# EAGLE design NAVMAN-GPSBOARD (EAGLE 6.5.0)
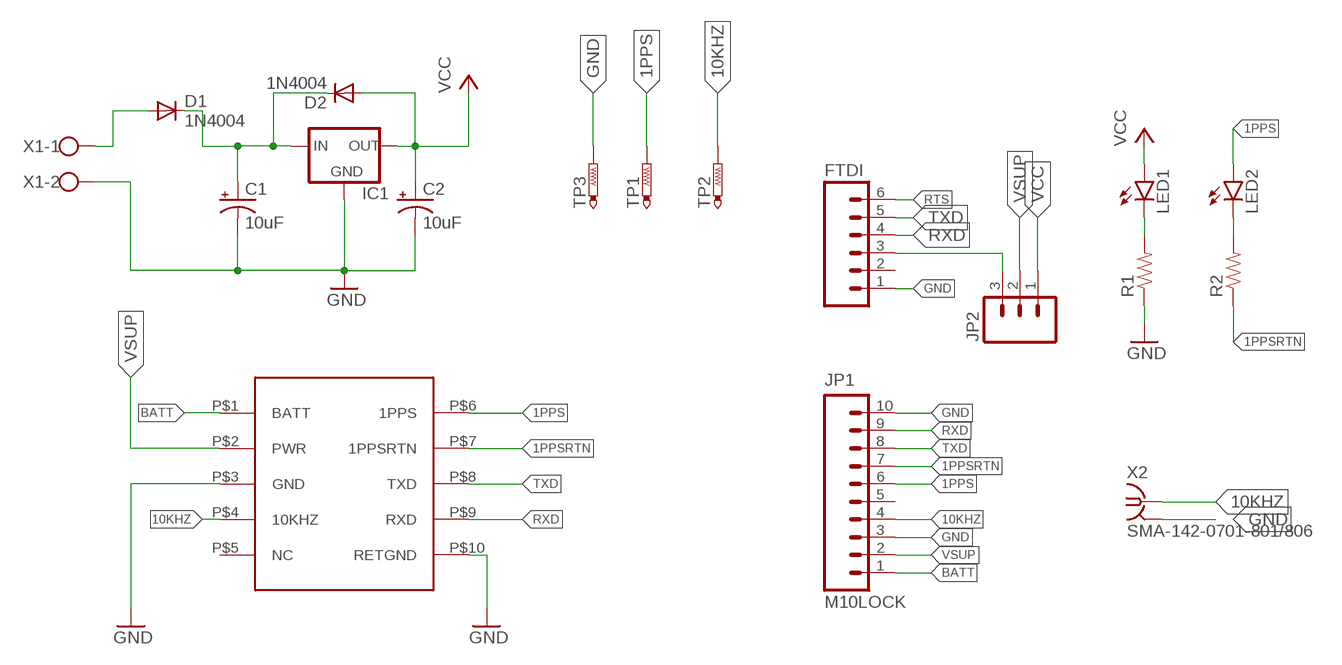
[diagram p0: schematic, sheet 1]

## Parts
C1  10uF  10UF-25V-20%(PTH)  [CPOL-RADIAL-10UF-25V]
C2  10uF  10UF-25V-20%(PTH)  [CPOL-RADIAL-10UF-25V]
D1  1N4004  [DO41-10]
D2  1N4004  [DO41-10]
FTDI  M06LOCK  [1X06_LOCK]
IC1  V_REG_78XXSINK  [TO220-IGO]
JP1  M10LOCK  [1X10_LOCK]
JP2  M03LOCK  [1X03_LOCK]
LED1  LED5MM  [LED5MM]
LED2  LED5MM  [LED5MM]
R1  RESISTORPTH-1/4W  [AXIAL-0.4]
R2  RESISTORPTH-1/4W  [AXIAL-0.4]
TP1  PTR1PAD1-20Y  [P1-20Y]
TP2  PTR1PAD1-20Y  [P1-20Y]
TP3  PTR1PAD1-20Y  [P1-20Y]
TU60-D001  NAVMANJUPITERTU60  [TU60-D001]
X1  W237-102  [W237-102]
X2  SMA-142-0701-801/806  [J502-ND-142-0701-801/806]

## Nets
1PPS: JP1.6 LED2.A TP1.TP TU60-D001.P$6(1PPS)
1PPSRTN: JP1.7 R2.P$1 TU60-D001.P$7(1PPSRTN)
10KHZ: JP1.4 TP2.TP TU60-D001.P$4(10KHZ) X2.1
BATT: JP1.1 TU60-D001.P$1(BATT)
GND: C1.2(-) C2.2(-) FTDI.1 IC1.GND JP1.3 JP1.10 R1.P$1 TP3.TP TU60-D001.P$3(GND) TU60-D001.P$10(RETGND) X1.2 X2.G@1 X2.G@2 X2.G@3 X2.G@4
N$1: C1.1(+) D1.C D2.C IC1.IN
N$2: LED1.K(C) R1.P$2
N$3: LED2.K(C) R2.P$2
N$4: FTDI.3 JP2.3
N$6: D1.A X1.1
RTS: FTDI.6
RXD: FTDI.4 JP1.9 TU60-D001.P$9(RXD)
TXD: FTDI.5 JP1.8 TU60-D001.P$8(TXD)
VCC: C2.1(+) D2.A IC1.OUT JP2.1 LED1.A
VSUP: JP1.2 JP2.2 TU60-D001.P$2(PWR)
Unconnected: FTDI.2 JP1.5 TU60-D001.P$5(NC)

## Library data of the parts
C1 C2 = SparkFun-Capacitors:10UF-25V-20%(PTH): CAP-08440; PROD_ID: CAP-08440
D1 D2 = diode:1N4004: DIODE general purpose rectifier, 1 A
FTDI = SparkFun-Connectors:M06: Header 6 Standard 6-pin 0.1" header. Use with straight break away headers (SKU : PRT-00116), right angle break away headers (PRT-00553), swiss pins (PRT-00743), machine pins (PRT-00117), and female headers (PRT-00115). Molex polarized connector foot print use with SKU : PRT-08094 with associated crimp pins and housings. NOTES ON THE VARIANTS LOCK and LOCK_LONGPADS... This footprint was designed to help hold the alignment of a through-hole component (i.e. 6-pin header) while soldering it into place. You may notice that each hole has been shifted either up or down by 0.005 of an inch from it's more standard position (which is a perfectly straight line). This slight alteration caused the pins (the squares in the middle) to touch the edges of the holes. Because they are alternating, it causes a "brace" to hold the component in place. 0.005 has proven to be the perfect amount of "off-center" position when using our standard breakaway headers. Although looks a little odd when you look at the bare footprint, once you have a header in there, the alteration is very hard to notice. Also,if you push a header all the way into place, it is covered up entirely on the bottom side. This idea of altering the position of holes to aid alignment will be further integrated into the Sparkfun Library for other footprints. It can help hold any component with 3 or more connection pins.
IC1 = SparkFun-PowerIC:V_REG_78XX: Voltage Regulator Standard 7805 5V regulator. IGO (Input Ground Output). Spark Fun Electronics SKU : COM-00107
JP1 = SparkFun-Connectors:M10: Header 10 Standard 10-pin 0.1" header. Use with straight break away headers (SKU : PRT-00116), right angle break away headers (PRT-00553), swiss pins (PRT-00743), machine pins (PRT-00117), and female headers (PRT-00115).
JP2 = SparkFun-Connectors:M03: Header 3 Standard 3-pin 0.1" header. Use with straight break away headers (SKU : PRT-00116), right angle break away headers (PRT-00553), swiss pins (PRT-00743), machine pins (PRT-00117), and female headers (PRT-00115). Molex polarized connector foot print use with SKU : PRT-08232 with associated crimp pins and housings.
LED1 LED2 = SparkFun-LED:LED: LEDs Standard schematic elements and footprints for 5mm, 3mm, 1206, and 0603 sized LEDs. 5mm - Spark Fun Electronics SKU : COM-00529 (and others)
R1 R2 = SparkFun-Resistors:RESISTOR: Resistor Basic schematic elements and footprints for 0603, 1206, and PTH resistors.
TP1-TP3 = testpad:PTR1: TEST PIN
TU60-D001 = navman:NAVMANJUPITERTU60
X1 = con-wago-500:W237-102: WAGO SCREW CLAMP; MPN: 237-102; OC_FARNELL: unknown; OC_NEWARK: 70K9898
X2 = con-coax:SMA-: SMA 50 Ohm End Launch Jack Receptacle - Round Contact Johnson Components Source: www.johnsoncomponents.com .. J502-ND.pdf; MF: JOHNSON COMPONENTS; MPN: 142-0701-801; OC_FARNELL: 1608592; OC_NEWARK: 90F2624

## Board
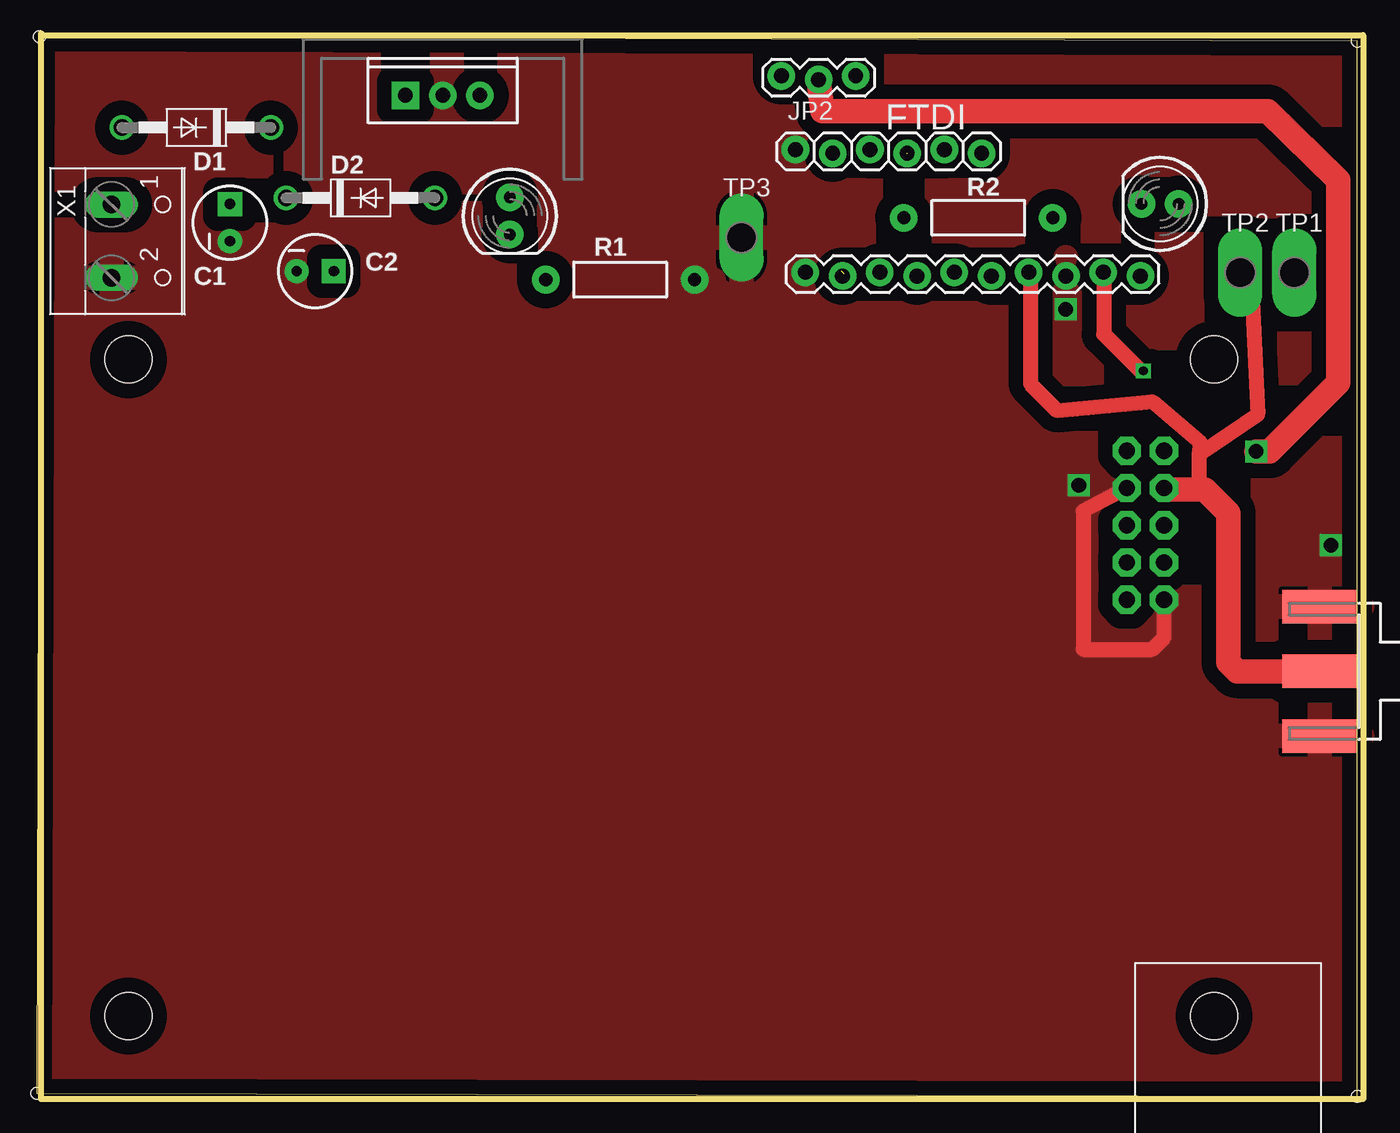
[diagram p1: board, top side]
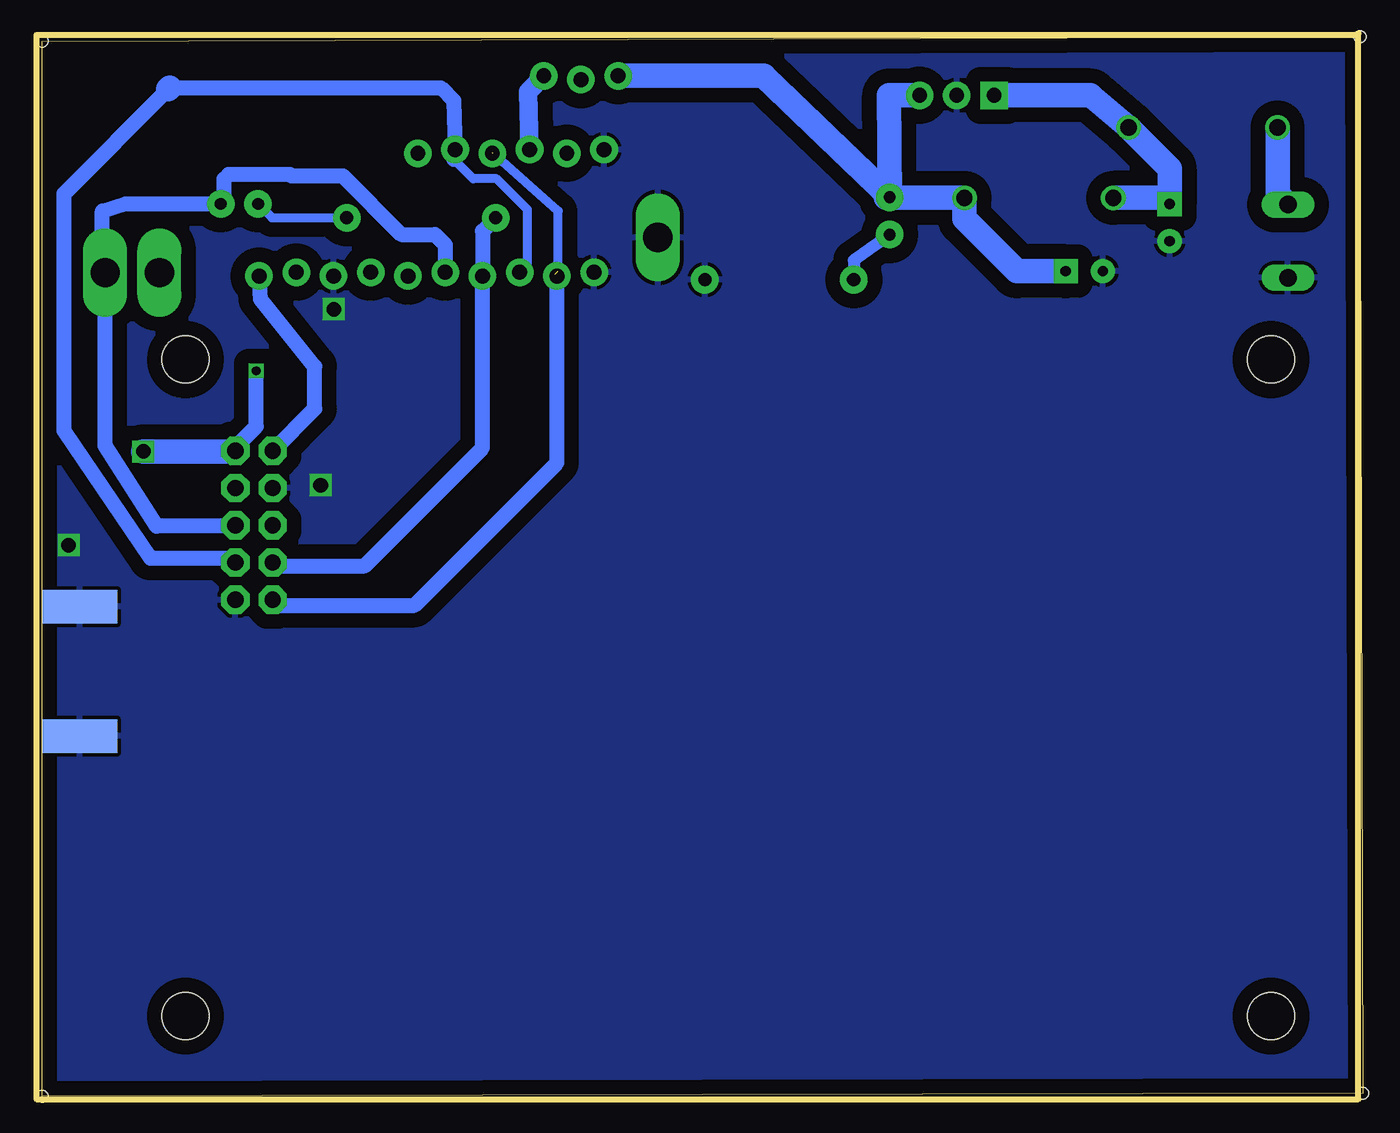
[diagram p2: board, bottom side, seen from below]

Size 90.1 x 72.3 mm. Coordinates in mm from the lower left corner, seen from the top.
Outline: 0,0.2 90.1,0 90.1,72 0.2,72.3 0,0.2
Copper layers (1*16): Top 0.035mm / dielectric 1.5mm / Bottom 0.035mm
Design rules "MrBeans": minimum track width 15mil, minimum drill 24mil, track to track 15mil, track to pad 15mil, pad to pad 15mil, via to via 15mil, smd to smd 8mil, copper to edge 40mil, drill to drill 8mil, minimum pad ring 10mil, minimum via ring 8mil, stop-mask expansion 4mil, vias tented up to drill 0mil, thermal gap 10mil
Holes 0.8 mm at 0,0.2 90.1,0 90.1,72 0.2,72.3
Milling: 4 lines

### Footprints (pad centres in the part's own frame; a part is rotated, then mirrored left to right if it is on the bottom)
CPOL-RADIAL-10UF-25V = drill 0.7 pad 1.651 square: 1 1.27,0 | drill 0.7 pad 1.651: 2 -1.27,0
DO41-10 = drill 1.118: A 5.08,0; C -5.08,0
1X06_LOCK = drill 1.016 pad 1.88: 1 0,0; 2 2.54,-0.254; 3 5.08,0; 4 7.62,-0.254; 5 10.16,0; 6 12.7,-0.254
TO220-IGO = drill 1 pad 1.88: GND 0,0; OUT 2.54,0 | drill 1 pad 1.88 square: IN -2.54,0
1X10_LOCK = drill 1.016 pad 1.88: 1 0,0.127; 2 2.54,-0.127; 3 5.08,0.127; 4 7.62,-0.127; 5 10.16,0.127; 6 12.7,-0.127; 7 15.24,0.127; 8 17.78,-0.127; 9 20.32,0.127; 10 22.86,-0.127
1X03_LOCK = drill 1.016 pad 1.88: 1 0,0.127; 2 2.54,-0.127; 3 5.08,0.127
LED5MM = drill 0.813 pad 1.88: A -1.27,0; K 1.27,0
AXIAL-0.4 = drill 0.9 pad 1.88: P$1 -5.08,0; P$2 5.08,0
P1-20Y = drill 2.007 pad 2.54 long: TP 0,0
TU60-D001 = drill 1.1 pad 1.93 octagon: P$1 42.57,9.44; P$2 42.57,6.9; P$3 40.03,9.44; P$4 40.03,6.9; P$5 37.49,9.44; P$6 37.49,6.9; P$7 34.95,9.44; P$8 34.95,6.9; P$9 32.41,9.44; P$10 32.41,6.9 | hole 3.2: 4,3.5; 48.8,3.5; 48.8,77.55; 4,77.55
W237-102 = drill 1.194 long: 1 -2.5,-1.27; 2 2.5,-1.27
J502-ND-142-0701-801/806 = smd 5.08 x 2.286: 1 2.565,0; G@1 2.565,4.42; G@2 2.565,-4.42 | smd 5.08 x 2.286 bottom: G@3 2.565,4.42; G@4 2.565,-4.42

### Placement (x,y rotation side)
C1  13.18,59.61 90 top
C2  19,56.3 0 top
D1  10.9,66.1 180 top
D2  22.1,61.3 0 top
FTDI  51.77,64.59 0 top
IC1  27.7,68.3 0 top
JP1  75.3,56.1 180 top
JP2  50.8,69.5 0 top
LED1  32.28,60.07 270 top
LED2  76.64,60.89 180 top
R1  39.81,55.72 180 top
R2  64.24,59.94 0 top
TP1  85.8,56.2 0 top
TP2  82.1,56.2 0 top
TP3  48.1,58.6 0 top
TU60-D001  83.82,1.47 90 top
X1  6.38,58.35 270 top
X2  90.1,29 180 top

### Tracks (layer width: path | path; a pad name or v marks a point on that pad's centre or on a via)
1PPS
  Bottom 0.61: TU60-D001.P$6 76.98,38.9 | TP1.TP 86,56.2 | LED2.A 77.7,61.1 | 77.7,62.6 77.4,62.9 | 73.2,62.9 73.1,62.8
  Bottom 1.016: 76.98,38.9 82.3,38.9 85.8,44.4 TP1.TP | 86,56.2 86,60.4 84.41,60.89 LED2.A | 77.7,61.1 77.7,62.6 | 77.4,62.9 73.2,62.9 | 73.1,62.8 69.6,62.8 65.6,58.8 63.3,58.8 62.6,58.1 JP1.6
1PPSRTN
  Bottom 1.016: TU60-D001.P$7 74.16,36.2 68.1,36.2 60.06,44.24 JP1.7 60.06,59.04 R2.P$1
10KHZ
  Top 1.016: TU60-D001.P$4 77.02,41.4 | 79.7,41.4 79.3,41.4 79.3,43.8 | 88.5,29 X2.1 | JP1.4 67.8,56.11 67.8,48.6 69.6,46.8 76.1,47.4 79.4,44.6 79.3,43.8 | TP2.TP 82.9,55 83.3,46.5 79.3,43.8
  Top 1.676: 77.02,41.4 79.3,41.4 | 79.7,41.4 81.3,39.8 81.3,29.6 81.9,29 X2.1
BATT
  Bottom 1.016: TU60-D001.P$1 71.5,46.92 71.5,49.8 75.2,54.4 JP1.1
GND  (via drill 1)
  Top 1.016: TU60-D001.P$3 71.4,39.92 71.4,30.5 76.1,30.5 76.92,31.32 TU60-D001.P$10
  other vias: 70.2,53.7 88.3,37.6 71.1,41.7
  pour Bottom (isolate 1): 0.6,71.7 90.5,71.7 90.7,1 0.8,1
  pour Top (isolate 1, rank 6): 1.2,71.9 90.6,71.9 90.6,1.2 1,1.2 1,71.7
N$1
  Bottom 1.016: C1.1 13.6,61.3
  Bottom 1.676: C1.1 13.18,63.3 D1.C 18.58,68.3 IC1.IN | 13.6,61.3 D2.C
N$2
  Bottom 0.813: LED1.K 34.73,57.05 R1.P$2
N$3
  Bottom 0.61: LED2.K 74.42,59.94 R2.P$2
N$4
  Bottom 1.27: JP2.3 56.95,68.56 FTDI.3
N$6
  Bottom 1.676: X1.1 5.82,61.56 D1.A
RXD  (2 unrouted)
  Bottom 0.61: 54.9,56.31 54.9,60.4 59.34,64.34
  Bottom 1.016: TU60-D001.P$9 74,33.5 64.7,33.5 54.98,43.22 JP1.9 55.11,56.1
TXD
  Bottom 0.61: JP1.8 57,56.75 57,60.5 59.1,62.6 60.7,62.6 62.03,63.93
  Bottom 1.016: TU60-D001.P$8 77.2,36.7 82.7,36.7 88.6,45.4 88.6,61.6 81.5,68.7 | 81.4,68.8 62.9,68.8 62.03,67.93 FTDI.5 62.03,63.93
  Bottom 1.676: 81.5,68.7 81.4,68.8
VCC
  Bottom 1.016: LED1.A 32.54,61.3
  Bottom 1.676: IC1.OUT 32.32,68.3 LED1.A 40.84,69.6 40.87,69.63 JP2.1 | 32.54,61.3 D2.A 27.18,59.88 23.6,56.3 C2.1
VSUP  (via drill 0.6, 1)
  Top 1.016: JP1.2 72.8,56.19 72.8,52 75.3,49.5 v75.5,49.5
  Top 1.676: JP2.2 53.61,67.2 84,67.2 88.8,62.5 88.8,48.7 84.1,44 v83.2,44
  Bottom 0.3: TU60-D001.P$2 76.8,44.04 76.8,44.4
  Bottom 1.016: 76.8,44.4 75.5,45.7 v75.5,49.5
  Bottom 1.676: TU60-D001.P$2 76.96,44 v83.2,44

### Text on the board
Reference: PPS
tDocu: V-SUPP | V-FTDI | GND | + | PWR | PWR | GND | RXD | TXD | 10KHZ | PPS | GND | BAT | BAT | PWR | GND | 10KHZ | GPS Disciplined Oscillator | PPS | Navman Jupiter Tu60 | PPSGND | TXD | Design by Jason Ball (jason@ball.net) | RXD | GND | 10KHZ | https://github.com/agronaught/GPS-Disciplined-Oscillator-GPSOXCO-.git